# EAGLE design 15214 (EAGLE 7.5.0)
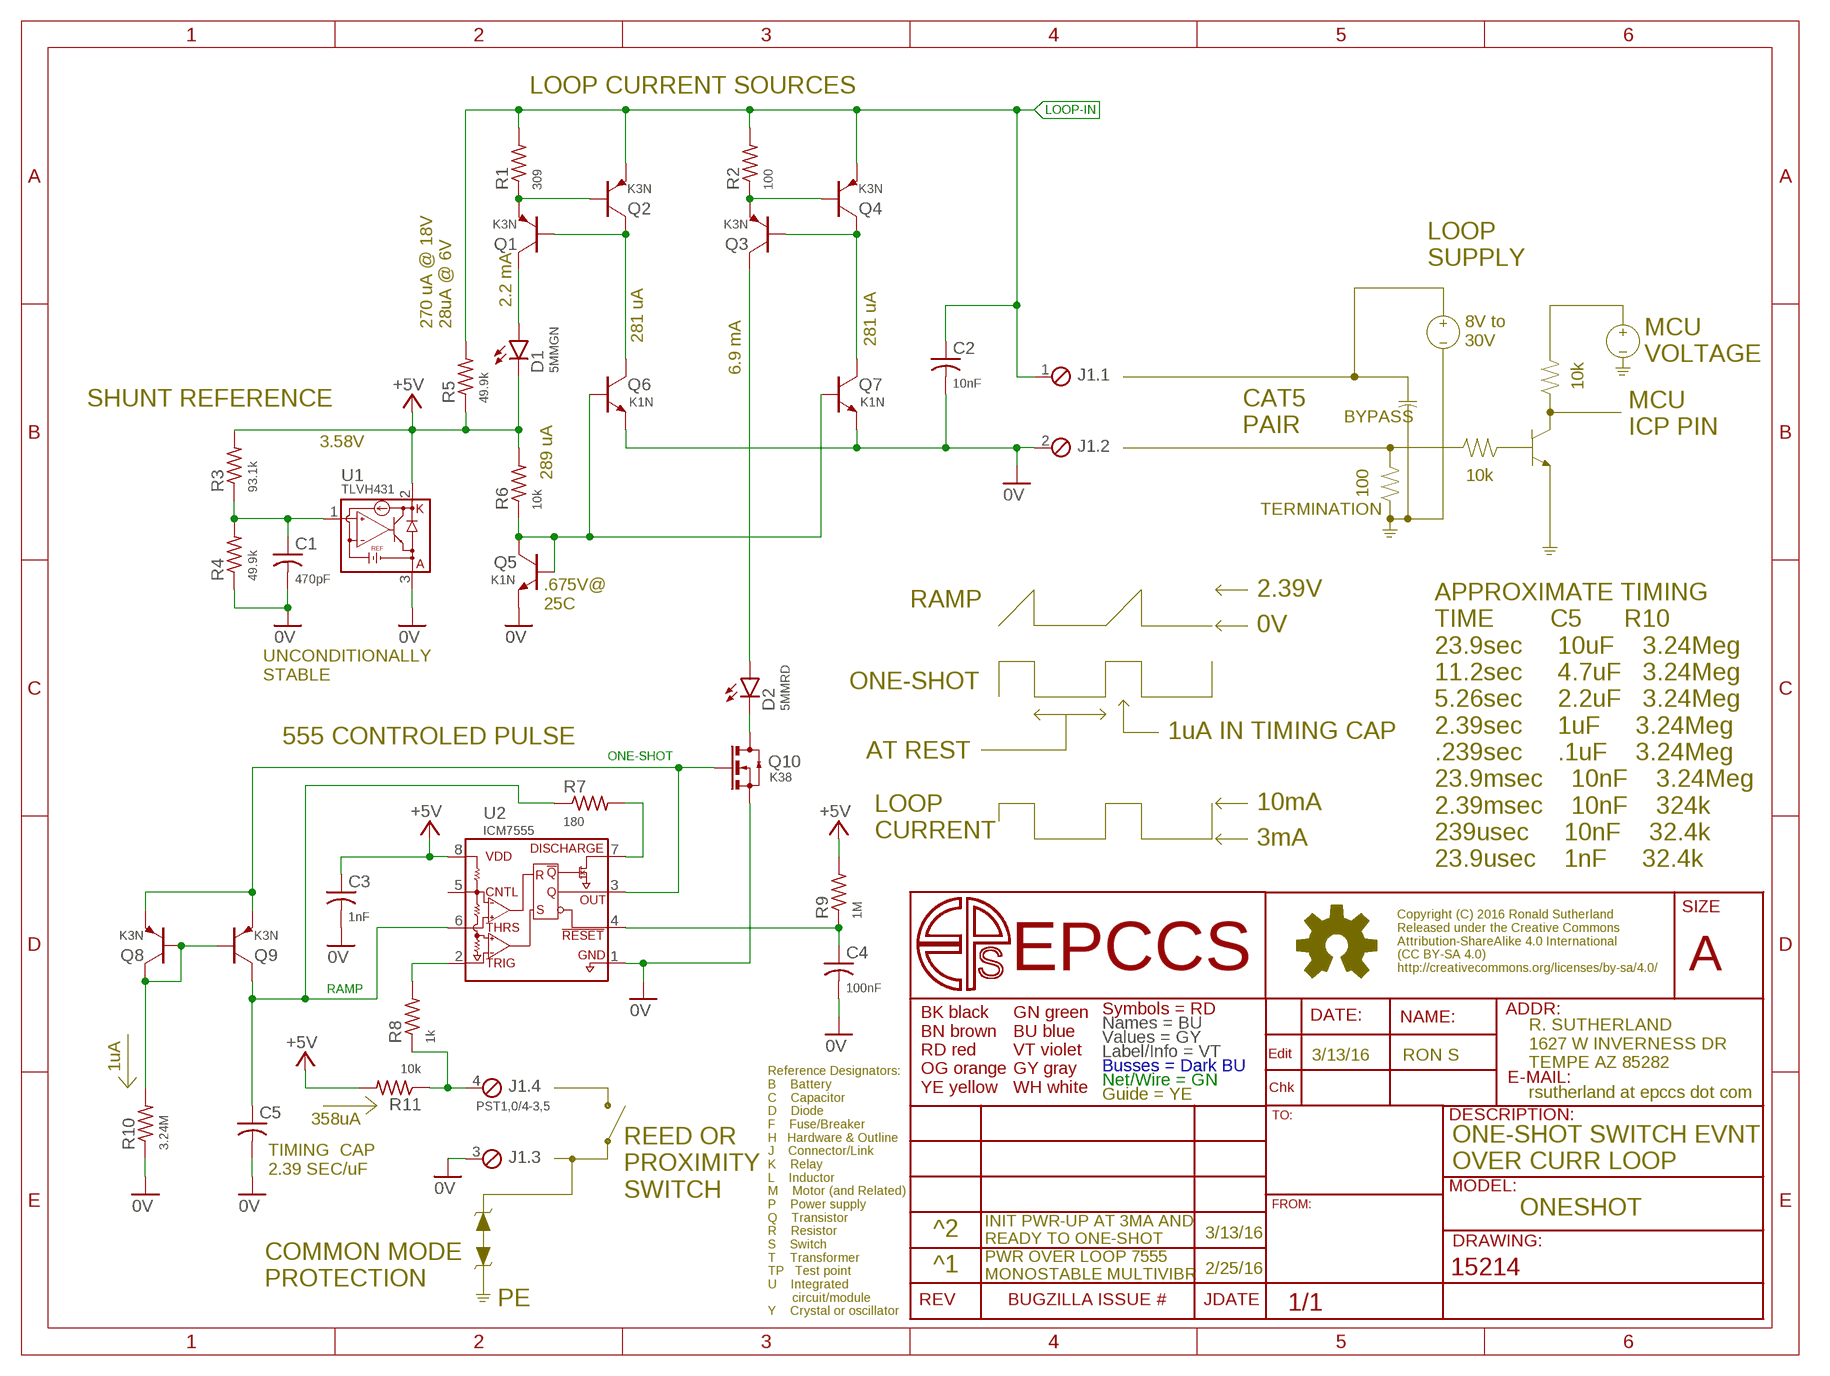
[diagram p0: schematic, sheet 1]

## Parts
C1  470pF  CC0603A  [C0603(1608)]
C2  10nF  CC0603A  [C0603(1608)]
C3  1nF  CC0603A  [C0603(1608)]
C4  100nF  CC0603A  [C0603(1608)]
C5  CC1210  [C1210(3225)]
D1  5MMGN  LED5MM  [LED5MM]
D2  5MMRD  LED5MM  [LED5MM]
J1  PST1,0/4-3,5  MCV4  [MCV4]
Q1  K3N  PNPSOT23  [SOT23]
Q2  K3N  PNPSOT23  [SOT23]
Q3  K3N  PNPSOT23  [SOT23]
Q4  K3N  PNPSOT23  [SOT23]
Q5  K1N  NPNSOT23  [SOT23]
Q6  K1N  NPNSOT23  [SOT23]
Q7  K1N  NPNSOT23  [SOT23]
Q8  K3N  PNPSOT23  [SOT23]
Q9  K3N  PNPSOT23  [SOT23]
Q10  K38  N-CHSOT23  [SOT23]
R1  309  R0805  [C0805(2012)]
R2  100  R0805  [C0805(2012)]
R3  93.1k  R0805  [C0805(2012)]
R4  49.9k  R0805  [C0805(2012)]
R5  49.9k  R0805  [C0805(2012)]
R6  10k  R0805  [C0805(2012)]
R7  180  R0805  [C0805(2012)]
R8  1k  R0805  [C0805(2012)]
R9  1M  R0805  [C0805(2012)]
R10  3.24M  R0805  [C0805(2012)]
R11  10k  R0805  [C0805(2012)]
U1  TLVH431  TL432SOT23  [SOT23]
U2  ICM7555  [SOIC8]

## Nets
0V: C1.2 C2.2 C3.2 C4.2 C5.2 J1.2 J1.3 Q5.E Q6.E Q7.E Q10.2(S)(S) R4.1 R10.1 U1.3(A) U2.1(GND)
+5V: C3.1 D1.K R3.2 R5.1 R6.2 R9.2 R11.2 U1.2(K) U2.8(VDD)
LOOP-IN: C2.1 J1.1 Q2.E Q4.E R1.2 R2.2 R5.2
N$1: J1.4 R8.1 R11.1
N$2: R8.2 U2.2(TRIG)
N$3: D1.A Q1.C
N$4: D2.K Q10.3(D)(D)
N$5: R7.2 U2.7(DISCHARGE)
N$6: C4.1 R9.1 U2.4(!RESET)
N$8: Q8.B Q8.C Q9.B R10.2
N$13: Q1.E Q2.B R1.1
N$14: Q1.B Q2.C Q6.C
N$15: Q3.E Q4.B R2.1
N$16: Q3.B Q4.C Q7.C
N$17: C1.1 R3.1 R4.2 U1.1(REF)
N$18: Q5.B Q5.C Q6.B Q7.B R6.1
ONE-SHOT: Q8.E Q9.E Q10.1(G)(G) U2.3(OUT)
PULSE: D2.A Q3.C
RAMP: C5.1 Q9.C R7.1 U2.6(THRS)
Unconnected: U2.5(CNTL)

## Notes on the sheet
- LOOP CURRENT SOURCES
- LOOP
  SUPPLY
- 2.2 mA
- 270 uA @ 18V
  28uA @ 6V
- 281 uA | 281 uA
- 8V to
  30V
- 10k
- MCU
  VOLTAGE
- 6.9 mA
- SHUNT REFERENCE
- BYPASS
- CAT5
  PAIR
- MCU
  ICP PIN
- 3.58V
- 10k
- 289 uA
- 100
- TERMINATION
- 2.39V
- RAMP
- .675V@
  25C
- 0V
- ONE-SHOT
- UNCONDITIONALLY 
  STABLE
- 555 CONTROLED PULSE | AT REST | 1uA IN TIMING CAP
- 10mA
- LOOP
  CURRENT
- 3mA
- APPROXIMATE TIMING
  TIME        C5      R10
  23.9sec     10uF    3.24Meg
  11.2sec     4.7uF   3.24Meg
  5.26sec     2.2uF   3.24Meg
  2.39sec     1uF     3.24Meg
  .239sec     .1uF    3.24Meg
  23.9msec    10nF    3.24Meg
  2.39msec    10nF    324k
  239usec     10nF    32.4k
  23.9usec    1nF     32.4k
- 3/13/16 | RON S
- 1uA
- 358uA
- ONE-SHOT SWITCH EVNT
  OVER CURR LOOP
- TIMING  CAP
  2.39 SEC/uF
- REED OR
  PROXIMITY
  SWITCH
- ONESHOT
- ^2 | 3/13/16
- INIT PWR-UP AT 3MA AND
  READY TO ONE-SHOT
- ^1 | 2/25/16
- PWR OVER LOOP 7555 
  MONOSTABLE MULTIVIBR
- COMMON MODE
  PROTECTION
- PE

## Library data of the parts
C1-C5 = C-C:C: CAPACITOR Symbol
D1 D2 = D-LED:LED: LED 120120WH [CREE,XHGAWT-00-0000-00000HXE1] LED WHITE 6500K 150LUM-W120120
J1 = J-HDR3.5mm:MCV4: MCV 1,5/4-G-3,5-RN [PHOENIX CONTACT,1843622] CONN HEADER SHROUDED 2POS 3.5MM PST 1,0/4-3,5 [PHOENIX CONTACT,1945119] CONN HEADER STRIP PIN 4POS 3.5MM MCVR 1,5& 4-ST-3,5 [PHOENIX CONTACT,1863178] CONN PLUG 4POS SCREW 3.5MM
Q1-Q4 Q8 Q9 = Q-PNP:PNP: BJT NPN General Purpose Amplifier
Q5-Q7 = Q-NPN:NPN: BJT NPN General Purpose Amplifier
Q10 = Q-NCH:N-CH?*: ENHANCEMENT MODE MOSFET SOT23 is BSS138 pinout
R1-R11 = R-C:R: Resiistor American-style symbol
U1 = U-Linear:TL432: WARNING: watch out for pinout on TL*43x BB [DIODES,TL432BSA-7] 2V5REF SHUNT ADJ 36V SOT23 Y3T [TI,TLVH431AIDBZ] 1V24REF SHUNT ADJ 18V SOT23
U2 = U-Time:ICM7555: ICM7555 [INTERSIL,ICM7555IBAZ-T] TIMER 555 8SOIC note each resistor in Maxim part is 100k +/- 20%

## Net classes
0 default: width 0.254 mm, drill 0.33 mm

## Board
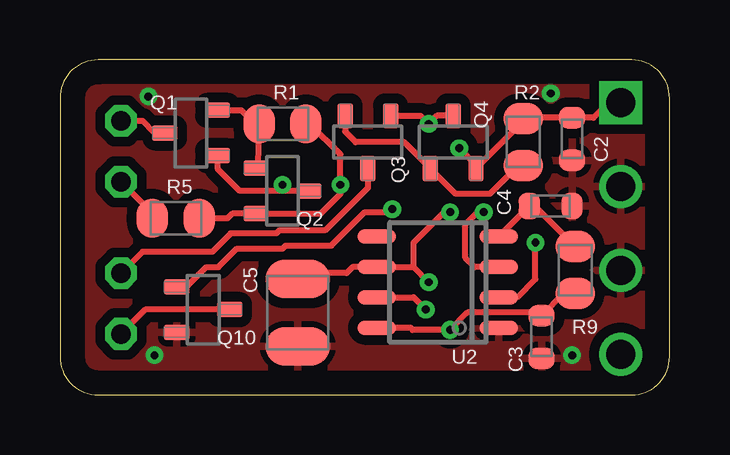
[diagram p1: board, top side]
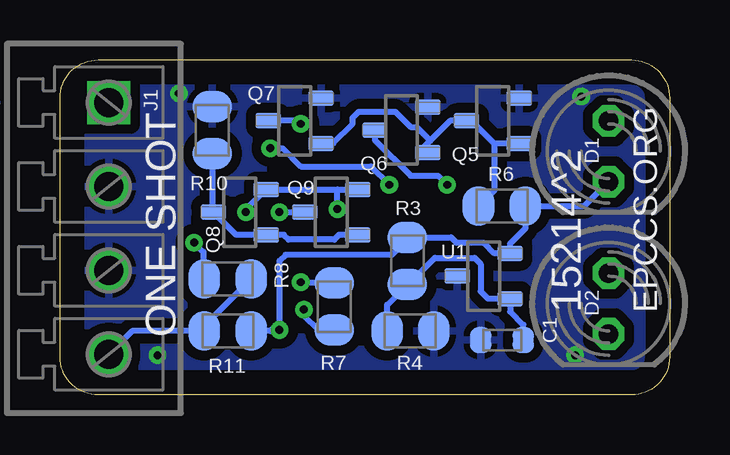
[diagram p2: board, bottom side, seen from below]

Size 25.4 x 13.97 mm. Coordinates in mm from the lower left corner, seen from the top.
Outline: 0,12.38 0,1.59 arc90 1.59,0 23.81,0 arc90 25.4,1.59 25.4,12.38 arc90 23.81,13.97 1.59,13.97 arc90 0,12.38
Copper layers (1*16): Top 0.035mm / dielectric 1.5mm / Bottom 0.035mm
Design rules "default *": minimum track width 10mil, minimum drill 16mil, track to track 8mil, track to pad 8mil, pad to pad 8mil, via to via 8mil, smd to smd 8mil, copper to edge 40mil, drill to drill 8mil, minimum pad ring 10mil, minimum via ring 8mil, stop-mask expansion 4mil, vias tented up to drill 17mil, thermal gap 10mil

### Footprints (pad centres in the part's own frame; a part is rotated, then mirrored left to right if it is on the bottom)
C0603(1608) = smd 0.898 x 1.1: 1 -0.889,0; 2 0.889,0
C1210(3225) = smd 1.6 x 2.7: 1 -1.4,0; 2 1.4,0
LED5MM = drill 0.813 octagon: A -1.27,0; K 1.27,0
MCV4 = drill 1.2 square: 1 0,0 | drill 1.2: 2 3.5,0; 3 7,0; 4 10.5,0
SOT23 = smd 0.65 x 1.06: B -0.95,-1.1; C 0,1.1; E 0.95,-1.1
SOT23' = smd 0.65 x 1.06: 1(G) -0.95,-1.1; 2(S) 0.95,-1.1; 3(D) 0,1.1
C0805(2012) = smd 1.321 x 1.651: 1 -0.977,0; 2 0.977,0
SOT23'' = smd 0.65 x 1.06: 1 -0.95,-1.1; 2 0.95,-1.1; 3 0,1.1
SOIC8 = smd 0.6 x 1.6: 1 -1.905,-2.54; 2 -0.635,-2.54; 3 0.635,-2.54; 4 1.905,-2.54; 5 1.905,2.54; 6 0.635,2.54; 7 -0.635,2.54; 8 -1.905,2.54

### Placement (x,y rotation side)
C1  6.99,2.29 180 bottom
C2  21.34,10.67 270 top
C3  20.07,2.41 270 top
C4  20.45,7.87 0 top
C5  9.91,3.43 270 top
D1  2.54,10.16 270 bottom
D2  2.54,3.81 270 bottom
J1  23.37,12.19 270 bottom
Q1  5.46,10.92 90 top
Q2  9.27,8.51 270 top
Q3  12.83,10.54 180 top
Q4  16.38,10.54 0 top
Q5  7.37,11.43 90 bottom
Q6  11.18,11.05 90 bottom
Q7  15.62,11.43 90 bottom
Q8  17.91,7.62 90 bottom
Q9  14.1,7.62 90 bottom
Q10  K38  [SOT23']  5.97,3.56 270 top
R1  9.27,11.3 0 top
R2  19.3,10.54 90 top
R3  10.92,5.59 90 bottom
R4  10.79,2.67 180 bottom
R5  4.83,7.37 0 top
R6  6.99,7.87 0 bottom
R7  13.97,3.68 270 bottom
R8  18.41,4.83 180 bottom
R9  21.46,5.21 270 top
R10  19.05,11.05 270 bottom
R11  18.41,2.67 0 bottom
U1  TLVH431  [SOT23'']  7.75,4.95 90 bottom
U2  15.75,4.7 90 top

### Tracks (layer width: path | path; a pad name or v marks a point on that pad's centre or on a via)
0V  (via drill 0.33)
  other vias: 20.45,12.57 3.94,1.65 21.34,1.65 3.68,12.45
  pour Bottom (isolate 0.406): 0,13.97 25.4,13.97 25.4,0 0,0
  pour Top (isolate 0.406): 0,13.97 25.4,13.97 25.4,0 0,0
+5V  (via drill 0.33)
  Top 0.254: U2.8 14.61,2.79 14.69,2.71 v16.26,2.71 16.98,3.43 19.94,3.43 C3.1 20.99,4.23 R9.2 | R5.1 3.85,7.58 D1.K
  Bottom 0.254: R11.2 16.64,2.67 16.64,2.71 v16.26,2.71 16.26,5.59 16,5.84 11.56,5.84 10.92,6.48 R3.2 9.11,6.57 8.89,6.35 7.75,6.35 7.3,5.9 U1.2 6.65,6.31 6.01,6.95 R6.2 3.56,7.87 D1.K
LOOP-IN  (via drill 0.33)
  Top 0.254: R5.2 6.99,7.37 7.18,7.56 Q2.E 10.86,7.56 11.68,8.38 v11.68,8.76 11.68,10.03 10.41,11.3 R1.2 | J1.1 22.86,12.19 22.23,11.56 C2.1 19.6,11.56 R2.2 19.16,11.26 Q4.E 17.33,9.59 v16.64,10.29
  Bottom 0.254: v16.64,10.29 16.13,10.29 15.37,9.53 12.45,9.53 v11.68,8.76
N$1
  Bottom 0.254: J1.4 22.39,2.67 R11.1 19.39,2.87 R8.1
N$2  (via drill 0.33)
  Top 0.254: U2.2 19.05,4.06 19.81,4.83 v19.81,6.35
  Bottom 0.254: v19.81,6.35 19.43,5.97 19.43,4.83 R8.2
N$3
  Top 0.254: D1.A 3.43,11.43 3.94,10.92 Q1.C
N$4
  Top 0.254: Q10.3(D) 3.56,3.56 D2.K
N$5  (via drill 0.33)
  Top 0.254: U2.7 14.73,4.06 v15.24,3.56
  Bottom 0.254: v15.24,3.56 15.24,3.3 14.64,2.71 R7.2
N$6
  Top 0.254: U2.4 C4.1 19.77,7.87 R9.1
N$8
  Bottom 0.254: Q9.B 13.78,6.67 13.97,6.48 15.88,6.48 16.07,6.67 Q8.B 18.06,6.67 Q8.C 19.05,7.66 R10.2
N$13
  Top 0.254: Q1.E 7.56,11.87 8.13,11.3 R1.1 8.26,9.53 8.19,9.46 Q2.B
N$14  (via drill 0.33)
  Top 0.254: Q2.C 9.27,8.51 | 9.27,8.51 7.49,8.51 6.56,9.44 Q1.B | v9.27,8.76 9.27,8.51
  Bottom 0.254: Q6.C 12.28,10.62 10.79,9.14 9.65,9.14 v9.27,8.76
N$15
  Top 0.254: R2.1 18.84,9.31 17.91,8.38 16.49,8.38 Q4.B 15.43,9.46 14.35,10.54 12.32,10.54 11.88,10.98 Q3.E
N$16  (via drill 0.33)
  Top 0.254: Q3.B 15.03,11.64 v15.37,11.3 15.71,11.64 Q4.C
  Bottom 0.254: v15.37,11.3 15.49,11.43 Q7.C
N$17
  Bottom 0.254: R4.2 11.77,3.76 R3.1 10.88,4.61 9.78,5.71 8.13,5.71 7.87,5.46 7.87,4.32 7.56,4 U1.1 6.65,3.47 6.1,2.92 C1.1
N$18
  Bottom 0.254: Q5.B 7.3,10.48 | 7.3,10.48 8.26,11.43 Q5.C 9.14,11.43 9.97,10.6 | Q6.B 10.22,10.35 9.97,10.6 | 7.3,10.48 7.3,8.53 R6.1 | Q7.B 14.01,10.5 13.21,11.3 13.21,11.56 12.95,11.81 11.43,11.81 10.79,11.18 10.54,11.18 9.97,10.6
ONE-SHOT  (via drill 0.33)
  Top 0.254: U2.3 17.27,5.33 16.89,5.71 16.89,7.11 17.4,7.62 v17.65,7.62 | Q10.1(G) 5.27,4.51 6.1,5.33 6.6,5.33 7.37,6.1 9.27,6.1 9.4,6.22 11.3,6.22 12.7,7.62 13.72,7.62 v13.84,7.75
  Bottom 0.254: v17.65,7.62 17.65,7.72 Q8.E 13.84,8.57 | 13.84,8.57 Q9.E | v13.84,7.75 13.84,8.57
PULSE
  Top 0.254: Q3.C 12.83,8.64 11.05,6.86 9.14,6.86 9.02,6.73 7.11,6.73 6.35,5.97 3.43,5.97 D2.A
RAMP  (via drill 0.33)
  Top 0.254: 14.73,5.33 U2.6 12.19,5.33 11.94,5.08 9.91,5.08 C5.1 | 14.73,5.33 v15.37,4.7 | 14.73,5.33 14.73,6.35 16,7.62 v16.26,7.62
  Bottom 0.254: R7.1 15.33,4.66 v15.37,4.7 | v16.26,7.62 Q9.C

### Text on the board
bPlace: EPCCS.ORG | 15214^2 | ONE SHOT